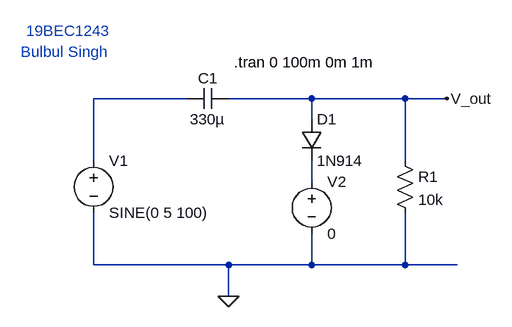
[diagram p0: schematic exp3_negative_clamper_task4.asc]
exp3_negative_clamper_task4.asc, the LTspice schematic file:
Version 4
SHEET 1 880 680
WIRE 176 32 32 32
WIRE 368 32 240 32
WIRE 512 32 368 32
WIRE 576 32 512 32
WIRE 368 64 368 32
WIRE 32 128 32 32
WIRE 512 128 512 32
WIRE 368 160 368 128
WIRE 32 288 32 208
WIRE 240 288 32 288
WIRE 368 288 368 240
WIRE 368 288 240 288
WIRE 512 288 512 208
WIRE 512 288 368 288
WIRE 592 288 512 288
WIRE 240 336 240 288
FLAG 576 32 V_out
FLAG 240 336 0
SYMBOL voltage 32 112 R0
WINDOW 123 0 0 Left 0
WINDOW 39 0 0 Left 0
SYMATTR InstName V1
SYMATTR Value SINE(0 5 100)
SYMBOL cap 240 16 R90
WINDOW 0 0 32 VBottom 2
WINDOW 3 32 32 VTop 2
SYMATTR InstName C1
SYMATTR Value 330µ
SYMBOL res 496 112 R0
SYMATTR InstName R1
SYMATTR Value 10k
SYMBOL voltage 368 144 R0
WINDOW 123 0 0 Left 0
WINDOW 39 0 0 Left 0
SYMATTR InstName V2
SYMATTR Value 0
SYMBOL diode 352 64 R0
SYMATTR InstName D1
SYMATTR Value 1N914
TEXT -72 -72 Left 2 ;19BEC1243
TEXT -80 -40 Left 2 ;Bulbul Singh
TEXT 248 -24 Left 2 !.tran 0 100m 0m 1m

The netlist it stands for:
* exp3_negative_clamper_task4.asc
V1 N001 0 SINE(0 5 100)
C1 V_out N001 330µ
R1 V_out 0 10k
V2 N002 0 0
D1 V_out N002 1N914
.model D D
.lib standard.dio
* 19BEC1243
* Bulbul Singh
.tran 0 100m 0m 1m
.backanno
.end